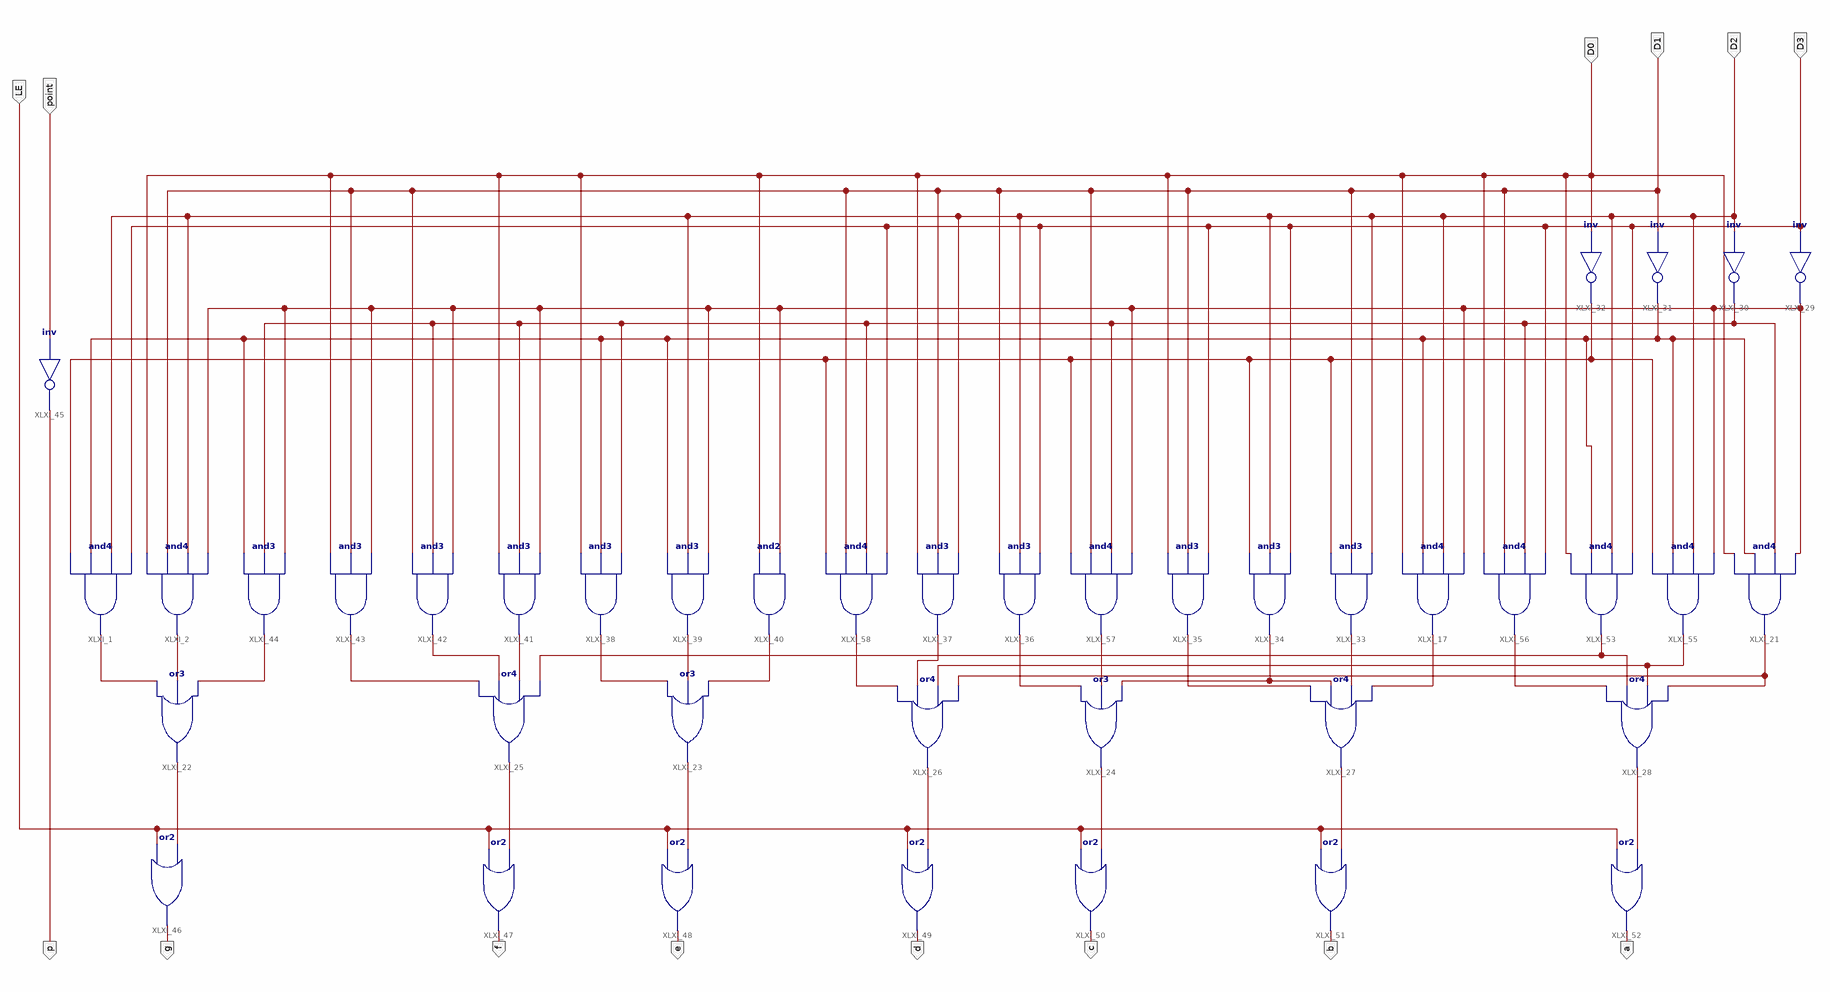
[diagram p0: schematic sheet 1]
// Xilinx ISE schematic MC14495_ZJU.sch (kintex7) as structural Verilog: 40 symbols, 14 ports
module MC14495_ZJU (
  input  D0,
  input  D1,
  input  D2,
  input  D3,
  input  point,
  input  LE,
  output p,
  output a,
  output b,
  output c,
  output d,
  output e,
  output f,
  output g
);

  wire _D0, _D1, _D2, _D3, XLXN_1, XLXN_2, XLXN_3, XLXN_4, XLXN_5, XLXN_6, XLXN_7, XLXN_8, XLXN_9, XLXN_10,
       XLXN_11, XLXN_12, XLXN_13, XLXN_14, XLXN_15, XLXN_16, XLXN_17, XLXN_18, XLXN_19, XLXN_21, XLXN_22,
       XLXN_43, XLXN_44, XLXN_45, XLXN_46, XLXN_47, XLXN_48, XLXN_49;

  and XLXI_1 (XLXN_2, _D0, _D1, D2, D3);
  and XLXI_2 (XLXN_1, D0, D1, D2, _D3);
  and XLXI_17 (XLXN_15, D0, _D1, D2, _D3);
  and XLXI_21 (XLXN_21, D0, _D1, _D2, _D3);
  or XLXI_22 (XLXN_49, XLXN_2, XLXN_1, XLXN_3);
  or XLXI_23 (XLXN_47, XLXN_8, XLXN_7, XLXN_9);
  or XLXI_24 (XLXN_45, XLXN_13, XLXN_12, XLXN_17);
  or XLXI_25 (XLXN_48, XLXN_4, XLXN_5, XLXN_6, XLXN_19);
  or XLXI_26 (XLXN_46, XLXN_10, XLXN_11, XLXN_22, XLXN_21);
  or XLXI_27 (XLXN_44, XLXN_16, XLXN_17, XLXN_14, XLXN_15);
  or XLXI_28 (XLXN_43, XLXN_18, XLXN_19, XLXN_22, XLXN_21);
  not XLXI_29 (_D3, D3);
  not XLXI_30 (_D2, D2);
  not XLXI_31 (_D1, D1);
  not XLXI_32 (_D0, D0);
  and XLXI_33 (XLXN_14, _D0, D1, D2);
  and XLXI_34 (XLXN_17, _D0, D2, D3);
  and XLXI_35 (XLXN_16, D0, D1, D3);
  and XLXI_36 (XLXN_13, D1, D2, D3);
  and XLXI_37 (XLXN_11, D0, D1, D2);
  and XLXI_38 (XLXN_8, D0, _D1, _D2);
  and XLXI_39 (XLXN_7, _D1, D2, _D3);
  and XLXI_40 (XLXN_9, D0, _D3);
  and XLXI_41 (XLXN_6, D0, _D2, _D3);
  and XLXI_42 (XLXN_5, D1, _D2, _D3);
  and XLXI_43 (XLXN_4, D0, D1, _D3);
  and XLXI_44 (XLXN_3, _D1, _D2, _D3);
  not XLXI_45 (p, point);
  or XLXI_46 (g, LE, XLXN_49);
  or XLXI_47 (f, LE, XLXN_48);
  or XLXI_48 (e, LE, XLXN_47);
  or XLXI_49 (d, LE, XLXN_46);
  or XLXI_50 (c, LE, XLXN_45);
  or XLXI_51 (b, LE, XLXN_44);
  or XLXI_52 (a, LE, XLXN_43);
  and XLXI_53 (XLXN_19, D0, _D1, D2, D3);
  and XLXI_55 (XLXN_22, _D0, _D1, D2, _D3);
  and XLXI_56 (XLXN_18, D0, D1, _D2, D3);
  and XLXI_57 (XLXN_12, _D0, D1, _D2, _D3);
  and XLXI_58 (XLXN_10, _D0, D1, _D2, D3);
endmodule
